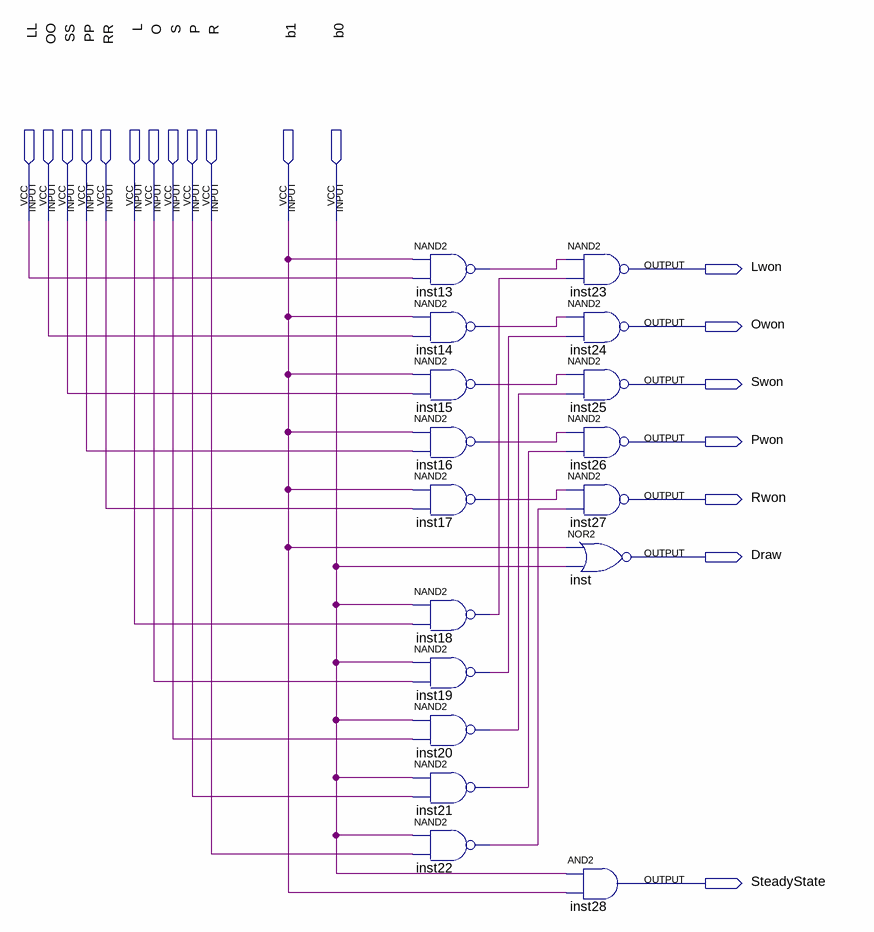
[diagram p0: schematic sheet]
// Quartus schematic whatwon.bdf as structural Verilog: 17 symbols, 19 pins
module whatwon (
  input  LL,
  input  OO,
  input  SS,
  input  PP,
  input  RR,
  input  L,
  input  O,
  input  S,
  input  P,
  input  R,
  input  b1,
  input  b0,
  output Lwon,
  output Owon,
  output Swon,
  output Pwon,
  output Rwon,
  output Draw,
  output SteadyState
);

  wire inst13_out, inst14_out, inst15_out, inst16_out, inst17_out, inst18_out, inst19_out, inst20_out,
       inst21_out, inst22_out;

  nand inst13 (inst13_out, b1, LL);
  nand inst14 (inst14_out, b1, OO);
  nand inst15 (inst15_out, b1, SS);
  nand inst16 (inst16_out, b1, PP);
  nand inst17 (inst17_out, b1, RR);
  nand inst18 (inst18_out, b0, L);
  nand inst19 (inst19_out, b0, O);
  nand inst20 (inst20_out, b0, S);
  nand inst21 (inst21_out, b0, P);
  nand inst22 (inst22_out, b0, R);
  nand inst23 (Lwon, inst13_out, inst18_out);
  nand inst24 (Owon, inst14_out, inst19_out);
  nand inst25 (Swon, inst15_out, inst20_out);
  nand inst26 (Pwon, inst16_out, inst21_out);
  nand inst27 (Rwon, inst17_out, inst22_out);
  nor inst (Draw, b1, b0);
  and inst28 (SteadyState, b0, b1);
endmodule
